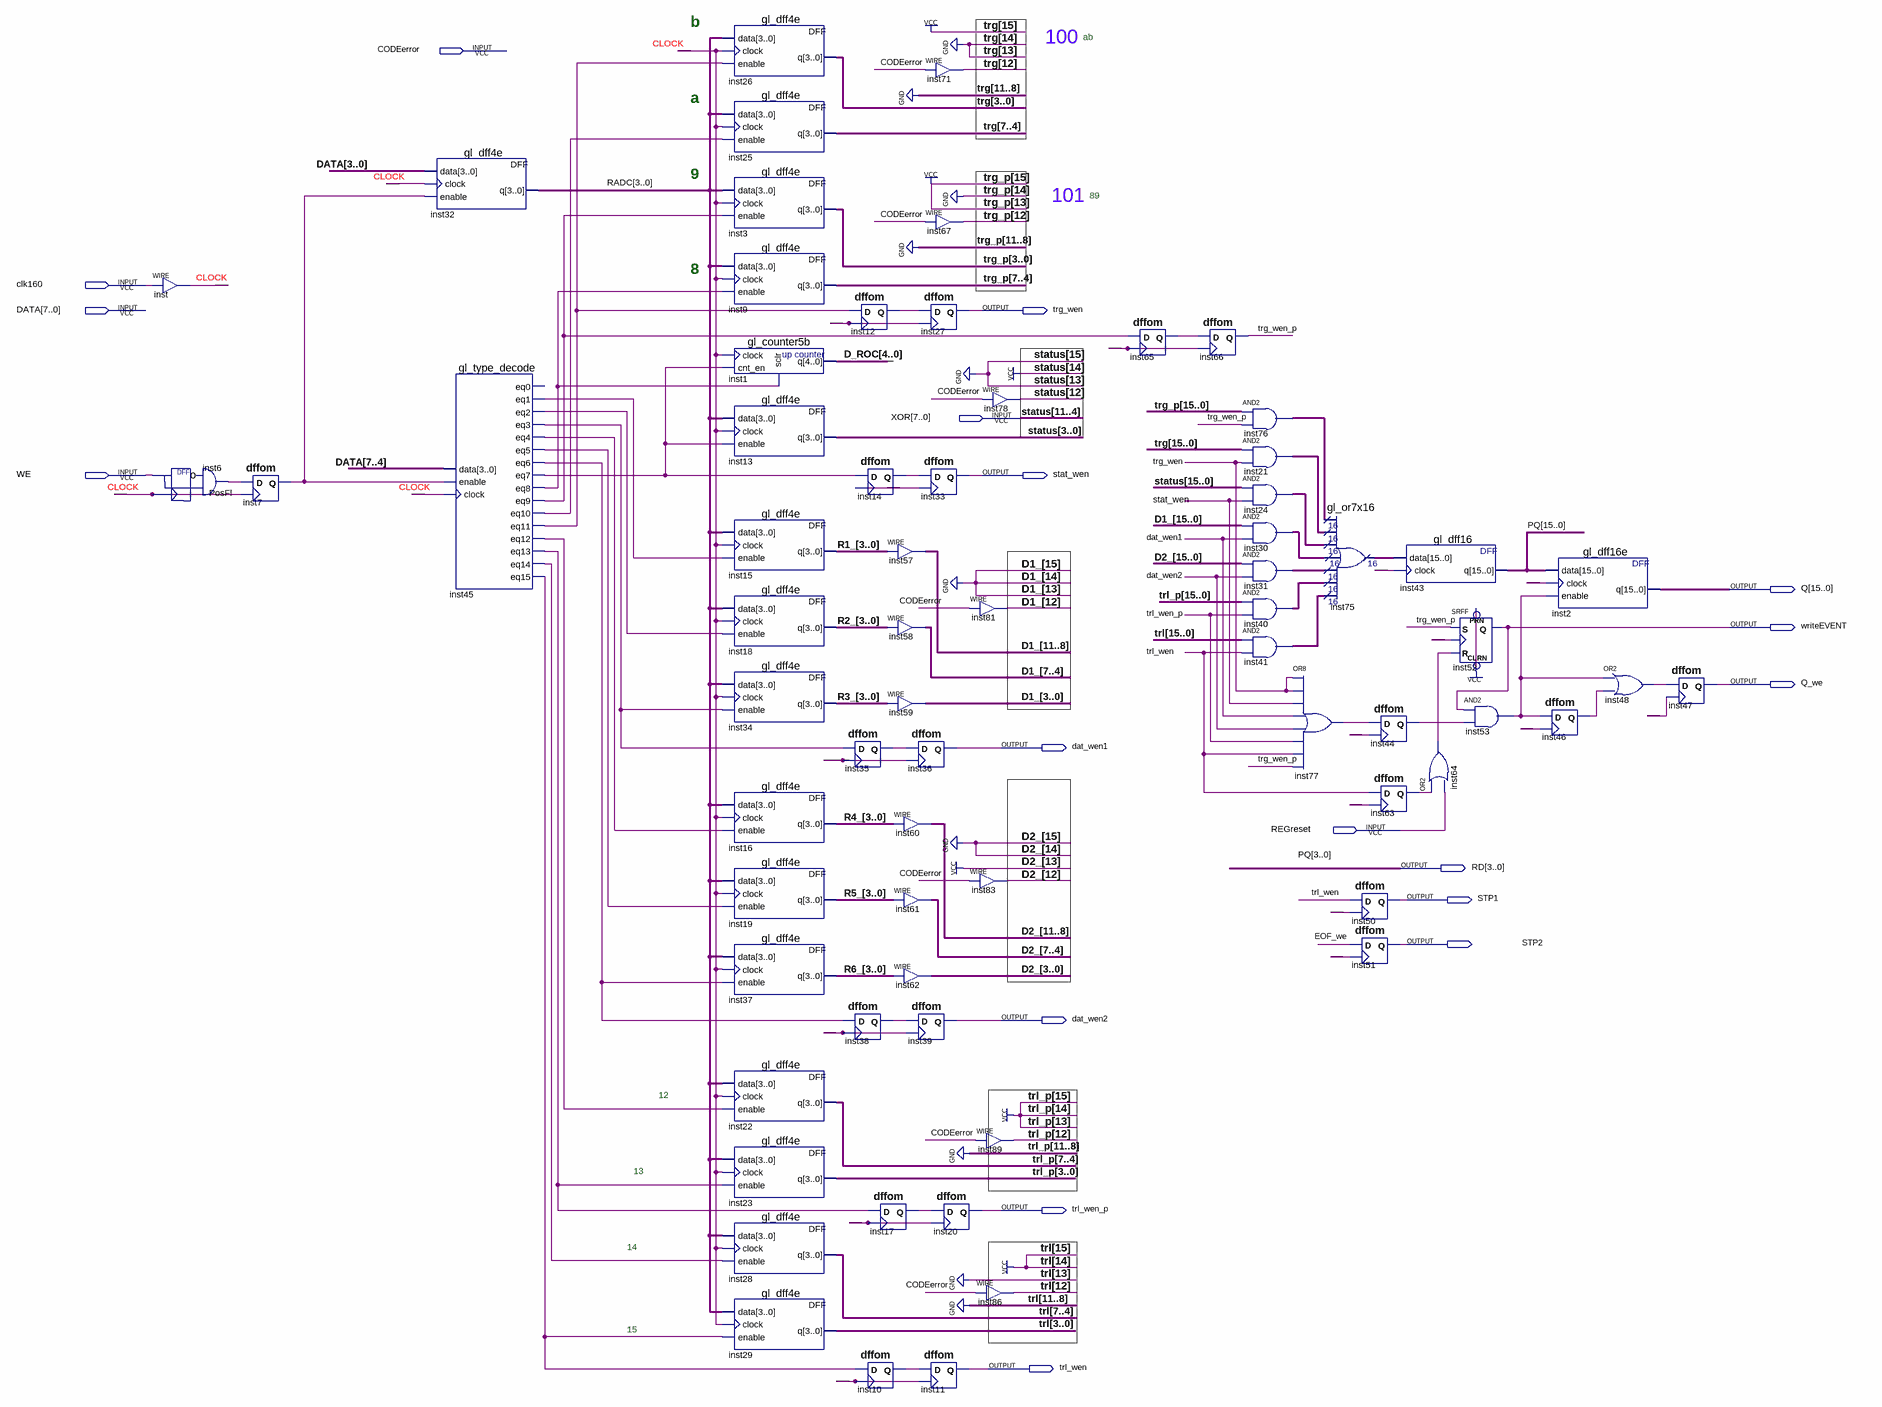
[diagram p0: schematic sheet]
// Quartus schematic DTB_serFSM_1.bdf as structural Verilog: 69 symbols, 18 pins
module DTB_serFSM_1 (
  input  CODEerror,
  input  clk160,
  input  [7:0] DATA,
  input  [7:0] XOR,
  input  WE,
  input  REGreset,
  output trg_wen,
  output stat_wen,
  output [15:0] Q,
  output writeEVENT,
  output Q_we,
  output dat_wen1,
  output [3:0] RD,
  output STP1,
  output STP2,
  output dat_wen2,
  output trl_wen_p,
  output trl_wen
);

  wire CLOCK, EOF_we, inst6_out, inst7_q, inst10_q, inst12_q, inst14_q, inst17_q, inst35_q, inst38_q,
       inst44_q, inst45_eq1, inst45_eq2, inst45_eq3, inst45_eq4, inst45_eq5, inst45_eq6, inst45_eq7,
       inst45_eq8, inst45_eq9, inst45_eq10, inst45_eq11, inst45_eq12, inst45_eq13, inst45_eq14, inst45_eq15,
       inst46_q, inst48_out, inst53_out, inst63_q, inst64_out, inst65_q, inst77_out, trg_wen_p;
  wire [3:0] R1_, R2_, R3_, R4_, R5_, R6_, RADC;
  wire [4:0] D_ROC;
  wire [12:0] D1_, D2_, status, trg, trg_p, trl, trl_p;
  wire [15:0] inst21_out, inst24_out, inst30_out, inst31_out, inst40_out, inst41_out, inst75_result,
       inst76_out;
  wire [15:4] PQ;

  assign CLOCK = clk160;  // WIRE inst
  PosFl inst6 (.CK(CLOCK), .IN(WE), .OUT(inst6_out));
  dffom inst7 (.D(inst6_out), .CK(CLOCK), .Q(inst7_q));
  gl_dff4e inst32 (.data(DATA[3:0]), .clock(CLOCK), .enable(inst7_q), .q(RADC));
  gl_type_decode inst45 (
    .data(DATA[7:4]), .enable(inst7_q), .clock(CLOCK), .eq1(inst45_eq1), .eq2(inst45_eq2), .eq3(inst45_eq3),
    .eq4(inst45_eq4), .eq5(inst45_eq5), .eq6(inst45_eq6), .eq7(inst45_eq7), .eq8(inst45_eq8),
    .eq9(inst45_eq9), .eq10(inst45_eq10), .eq11(inst45_eq11), .eq12(inst45_eq12), .eq13(inst45_eq13),
    .eq14(inst45_eq14), .eq15(inst45_eq15));  // open: eq0
  gl_dff4e inst26 (.data(RADC), .clock(CLOCK), .enable(inst45_eq11), .q(trg[3:0]));
  gl_dff4e inst25 (.data(RADC), .clock(CLOCK), .enable(inst45_eq10), .q(trg[7:4]));
  gl_dff4e inst3 (.data(RADC), .clock(CLOCK), .enable(inst45_eq9), .q(trg_p[3:0]));
  gl_dff4e inst9 (.data(RADC), .clock(CLOCK), .enable(inst45_eq8), .q(trg_p[7:4]));
  gl_counter5b inst1 (.sclr(inst45_eq8), .clock(CLOCK), .cnt_en(inst45_eq7), .q(D_ROC));
  gl_dff4e inst13 (.data(RADC), .clock(CLOCK), .enable(inst45_eq7), .q(status[3:0]));
  gl_dff4e inst15 (.data(RADC), .clock(CLOCK), .enable(inst45_eq1), .q(R1_));
  gl_dff4e inst18 (.data(RADC), .clock(CLOCK), .enable(inst45_eq2), .q(R2_));
  gl_dff4e inst34 (.data(RADC), .clock(CLOCK), .enable(inst45_eq3), .q(R3_));
  gl_dff4e inst16 (.data(RADC), .clock(CLOCK), .enable(inst45_eq4), .q(R4_));
  gl_dff4e inst19 (.data(RADC), .clock(CLOCK), .enable(inst45_eq5), .q(R5_));
  gl_dff4e inst37 (.data(RADC), .clock(CLOCK), .enable(inst45_eq6), .q(R6_));
  gl_dff4e inst22 (.data(RADC), .clock(CLOCK), .enable(inst45_eq12), .q(trl_p[7:4]));
  gl_dff4e inst23 (.data(RADC), .clock(CLOCK), .enable(inst45_eq13), .q(trl_p[3:0]));
  gl_dff4e inst28 (.data(RADC), .clock(CLOCK), .enable(inst45_eq14), .q(trl[7:4]));
  gl_dff4e inst29 (.data(RADC), .clock(CLOCK), .enable(inst45_eq15), .q(trl[3:0]));
  dffom inst12 (.D(inst45_eq11), .CK(CLOCK), .Q(inst12_q));
  dffom inst14 (.D(inst45_eq7), .CK(CLOCK), .Q(inst14_q));
  dffom inst35 (.D(inst45_eq3), .CK(CLOCK), .Q(inst35_q));
  dffom inst38 (.D(inst45_eq6), .CK(CLOCK), .Q(inst38_q));
  dffom inst17 (.D(inst45_eq13), .CK(CLOCK), .Q(inst17_q));
  dffom inst10 (.D(inst45_eq15), .CK(CLOCK), .Q(inst10_q));
  dffom inst27 (.D(inst12_q), .CK(CLOCK), .Q(trg_wen));
  dffom inst33 (.D(inst14_q), .CK(CLOCK), .Q(stat_wen));
  assign D1_[11:8] = R1_;  // WIRE inst57
  assign D1_[7:4] = R2_;  // WIRE inst58
  assign D1_[3:0] = R3_;  // WIRE inst59
  dffom inst36 (.D(inst35_q), .CK(CLOCK), .Q(dat_wen1));
  assign D2_[11:8] = R4_;  // WIRE inst60
  assign D2_[7:4] = R5_;  // WIRE inst61
  assign D2_[3:0] = R6_;  // WIRE inst62
  dffom inst39 (.D(inst38_q), .CK(CLOCK), .Q(dat_wen2));
  dffom inst11 (.D(inst10_q), .CK(CLOCK), .Q(trl_wen));
  assign trg[12] = CODEerror;  // WIRE inst71
  assign trg_p[12] = CODEerror;  // WIRE inst67
  assign D1_[12] = CODEerror;  // WIRE inst81
  assign D2_[12] = CODEerror;  // WIRE inst83
  dffom inst20 (.D(inst17_q), .CK(CLOCK), .Q(trl_wen_p));
  assign status[12] = CODEerror;  // WIRE inst78
  assign trl_p[12] = CODEerror;  // WIRE inst89
  assign trl[12] = CODEerror;  // WIRE inst86
  dffom inst65 (.D(inst45_eq9), .CK(CLOCK), .Q(inst65_q));
  dffom inst66 (.D(inst65_q), .CK(CLOCK), .Q(trg_wen_p));
  assign inst76_out = {3'b101, trg_p[12], 4'b0000, trg_p[7:0]} & {16{trg_wen_p}};  // AND2 inst76, 16 bits wide
  assign inst21_out = {3'b100, trg[12], 4'b0000, trg[7:0]} & {16{trg_wen}};  // AND2 inst21, 16 bits wide
  assign inst24_out = {3'b010, status[12], XOR, status[3:0]} & {16{stat_wen}};  // AND2 inst24, 16 bits wide
  assign inst30_out = {3'b000, D1_} & {16{dat_wen1}};  // AND2 inst30, 16 bits wide
  assign inst31_out = {3'b001, D2_} & {16{dat_wen2}};  // AND2 inst31, 16 bits wide
  assign inst40_out = {3'b111, trl_p[12], 4'b0000, trl_p[7:0]} & {16{trl_wen_p}};  // AND2 inst40, 16 bits wide
  assign inst41_out = {3'b110, trl[12], 4'b0000, trl[7:0]} & {16{trl_wen}};  // AND2 inst41, 16 bits wide
  gl_or7x16 inst75 (
    .data0x(inst76_out), .data1x(inst21_out), .data2x(inst24_out), .data3x(inst30_out), .data4x(inst31_out),
    .data5x(inst40_out), .data6x(inst41_out), .result(inst75_result));
  or inst77 (inst77_out, trg_wen, trg_wen, stat_wen, dat_wen1, dat_wen2, trl_wen_p, trl_wen, trg_wen_p);
  dffom inst44 (.D(inst77_out), .CK(CLOCK), .Q(inst44_q));
  dffom inst63 (.D(trl_wen), .CK(CLOCK), .Q(inst63_q));
  dffom inst50 (.D(trl_wen), .CK(CLOCK), .Q(STP1));
  dffom inst51 (.D(EOF_we), .CK(CLOCK), .Q(STP2));
  gl_dff16 inst43 (.data(inst75_result), .clock(CLOCK), .q({PQ, RD}));
  or inst64 (inst64_out, inst63_q, REGreset);
  SRFF inst52 (.PRN(1'b1), .CLRN(1'b1), .S(trg_wen_p), .R(inst64_out), .CLK(CLOCK), .Q(writeEVENT));
  and inst53 (inst53_out, writeEVENT, inst44_q);
  gl_dff16e inst2 (.data({PQ, RD}), .clock(CLOCK), .enable(inst53_out), .q(Q));
  dffom inst46 (.D(inst53_out), .CK(CLOCK), .Q(inst46_q));
  or inst48 (inst48_out, inst53_out, inst46_q);
  dffom inst47 (.D(inst48_out), .CK(CLOCK), .Q(Q_we));

  // Other names for the same wires on the sheet: PQ[3:0] = RD; status[11:4] = XOR

  // Notes on the sheet:
  //   b
  //   100
  //   ab
  //   a
  //   9
  //   101
  //   89
  //   8
  //   12
  //   13
  //   14
  //   15
endmodule
